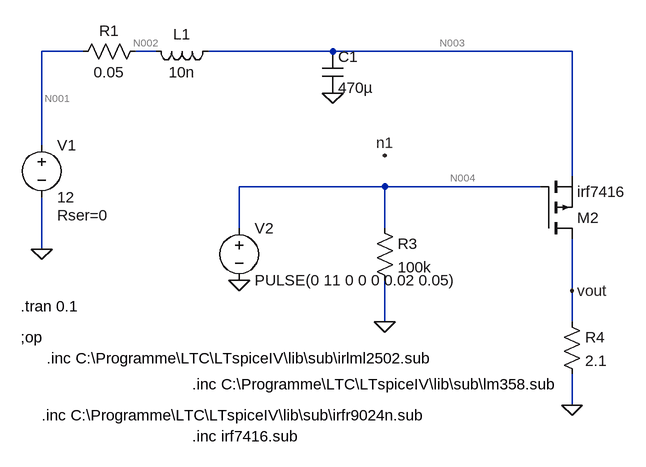
[diagram p0: schematic modell_pwm_drv3.asc]
modell_pwm_drv3.asc, the LTspice schematic file:
Version 4
SHEET 1 1676 680
WIRE -64 -48 -128 -48
WIRE 48 -48 16 -48
WIRE 320 -48 128 -48
WIRE 688 -48 320 -48
WIRE -128 96 -128 -48
WIRE 688 144 688 -48
WIRE 400 160 176 160
WIRE 640 160 400 160
WIRE 176 224 176 160
WIRE 400 224 400 160
WIRE -128 256 -128 176
WIRE 688 320 688 240
WIRE 400 368 400 304
WIRE 688 368 688 320
WIRE 688 496 688 448
FLAG -128 256 0
FLAG 400 112 n1
FLAG 400 368 0
FLAG 688 496 0
FLAG 688 320 vout
FLAG 176 304 0
FLAG 320 16 0
SYMBOL voltage -128 80 R0
WINDOW 123 0 0 Left 2
WINDOW 39 24 124 Left 2
SYMATTR SpiceLine Rser=0
SYMATTR InstName V1
SYMATTR Value 12
SYMBOL voltage 176 208 R0
WINDOW 123 0 0 Left 2
WINDOW 39 0 0 Left 2
SYMATTR InstName V2
SYMATTR Value PULSE(0 11 0 0 0 0.02 0.05)
SYMBOL res 672 352 R0
SYMATTR InstName R4
SYMATTR Value 2.1
SYMBOL pmos 640 240 M180
SYMATTR InstName M2
SYMATTR Value irf7416
SYMATTR Prefix X
SYMBOL res 384 208 R0
SYMATTR InstName R3
SYMATTR Value 100k
SYMBOL res 32 -64 R90
WINDOW 0 0 56 VBottom 2
WINDOW 3 32 56 VTop 2
SYMATTR InstName R1
SYMATTR Value 0.05
SYMBOL ind 144 -64 R90
WINDOW 0 5 56 VBottom 2
WINDOW 3 32 56 VTop 2
SYMATTR InstName L1
SYMATTR Value 10n
SYMBOL cap 304 -48 R0
SYMATTR InstName C1
SYMATTR Value 470µ
TEXT -120 424 Left 2 !.inc C:\\Programme\\LTC\\LTspiceIV\\lib\\sub\\irlml2502.sub
TEXT -128 512 Left 2 !.inc C:\\Programme\\LTC\\LTspiceIV\\lib\\sub\\irfr9024n.sub
TEXT -160 392 Left 2 !;op
TEXT 104 464 Left 2 !.inc C:\\Programme\\LTC\\LTspiceIV\\lib\\sub\\lm358.sub
TEXT -160 344 Left 2 !.tran 0.1
TEXT 104 544 Left 2 !.inc irf7416.sub

The netlist it stands for:
* modell_pwm_drv3.asc
V1 N001 0 12 Rser=0
V2 N004 0 PULSE(0 11 0 0 0 0.02 0.05)
R4 vout 0 2.1
XM2 vout N004 N003 irf7416  ; pins D G S
R3 N004 0 100k
R1 N002 N001 0.05
L1 N003 N002 10n
C1 N003 0 470µ
.inc C:\Programme\LTC\LTspiceIV\lib\sub\irlml2502.sub
.inc C:\Programme\LTC\LTspiceIV\lib\sub\irfr9024n.sub
;op
.inc C:\Programme\LTC\LTspiceIV\lib\sub\lm358.sub
.tran 0.1
.inc irf7416.sub
.backanno
.end

* Results of the author's LTspice run, read from the files saved beside the schematic
* Operating Point, zero values left out:
*   V(n001) = 12 V
*   V(vout) = 11.62 V
*   V(n003) = 11.72 V
*   V(n002) = 11.72 V
*   I(L1) = -5.536 A
*   I(R1) = -5.536 A
*   I(R4) = 5.536 A
*   I(V1) = -5.536 A
*   Ix(m2:1) = -5.536 A
*   Ix(m2:3) = 5.536 A
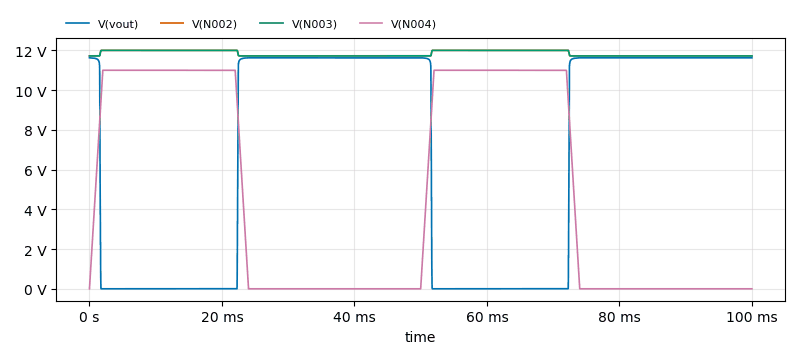
[diagram p1: Transient Analysis of modell_pwm_drv3.asc, plotted from the saved traces]
* Transient Analysis, 1 run:
*   V(vout): min -25.68 µV, max 11.62 V, average 6.793 V, rms 8.876 V, last 11.62 V
*   V(N002): min 11.72 V, max 12 V, average 11.84 V, rms 11.84 V, last 11.72 V
*   V(N003): min 11.72 V, max 12 V, average 11.84 V, rms 11.84 V, last 11.72 V
*   V(N004): min 0 V, max 11 V, average 4.84 V, rms 7.185 V, last 0 V